# Altium project МПСУ.464414.22-01.PrjPcb
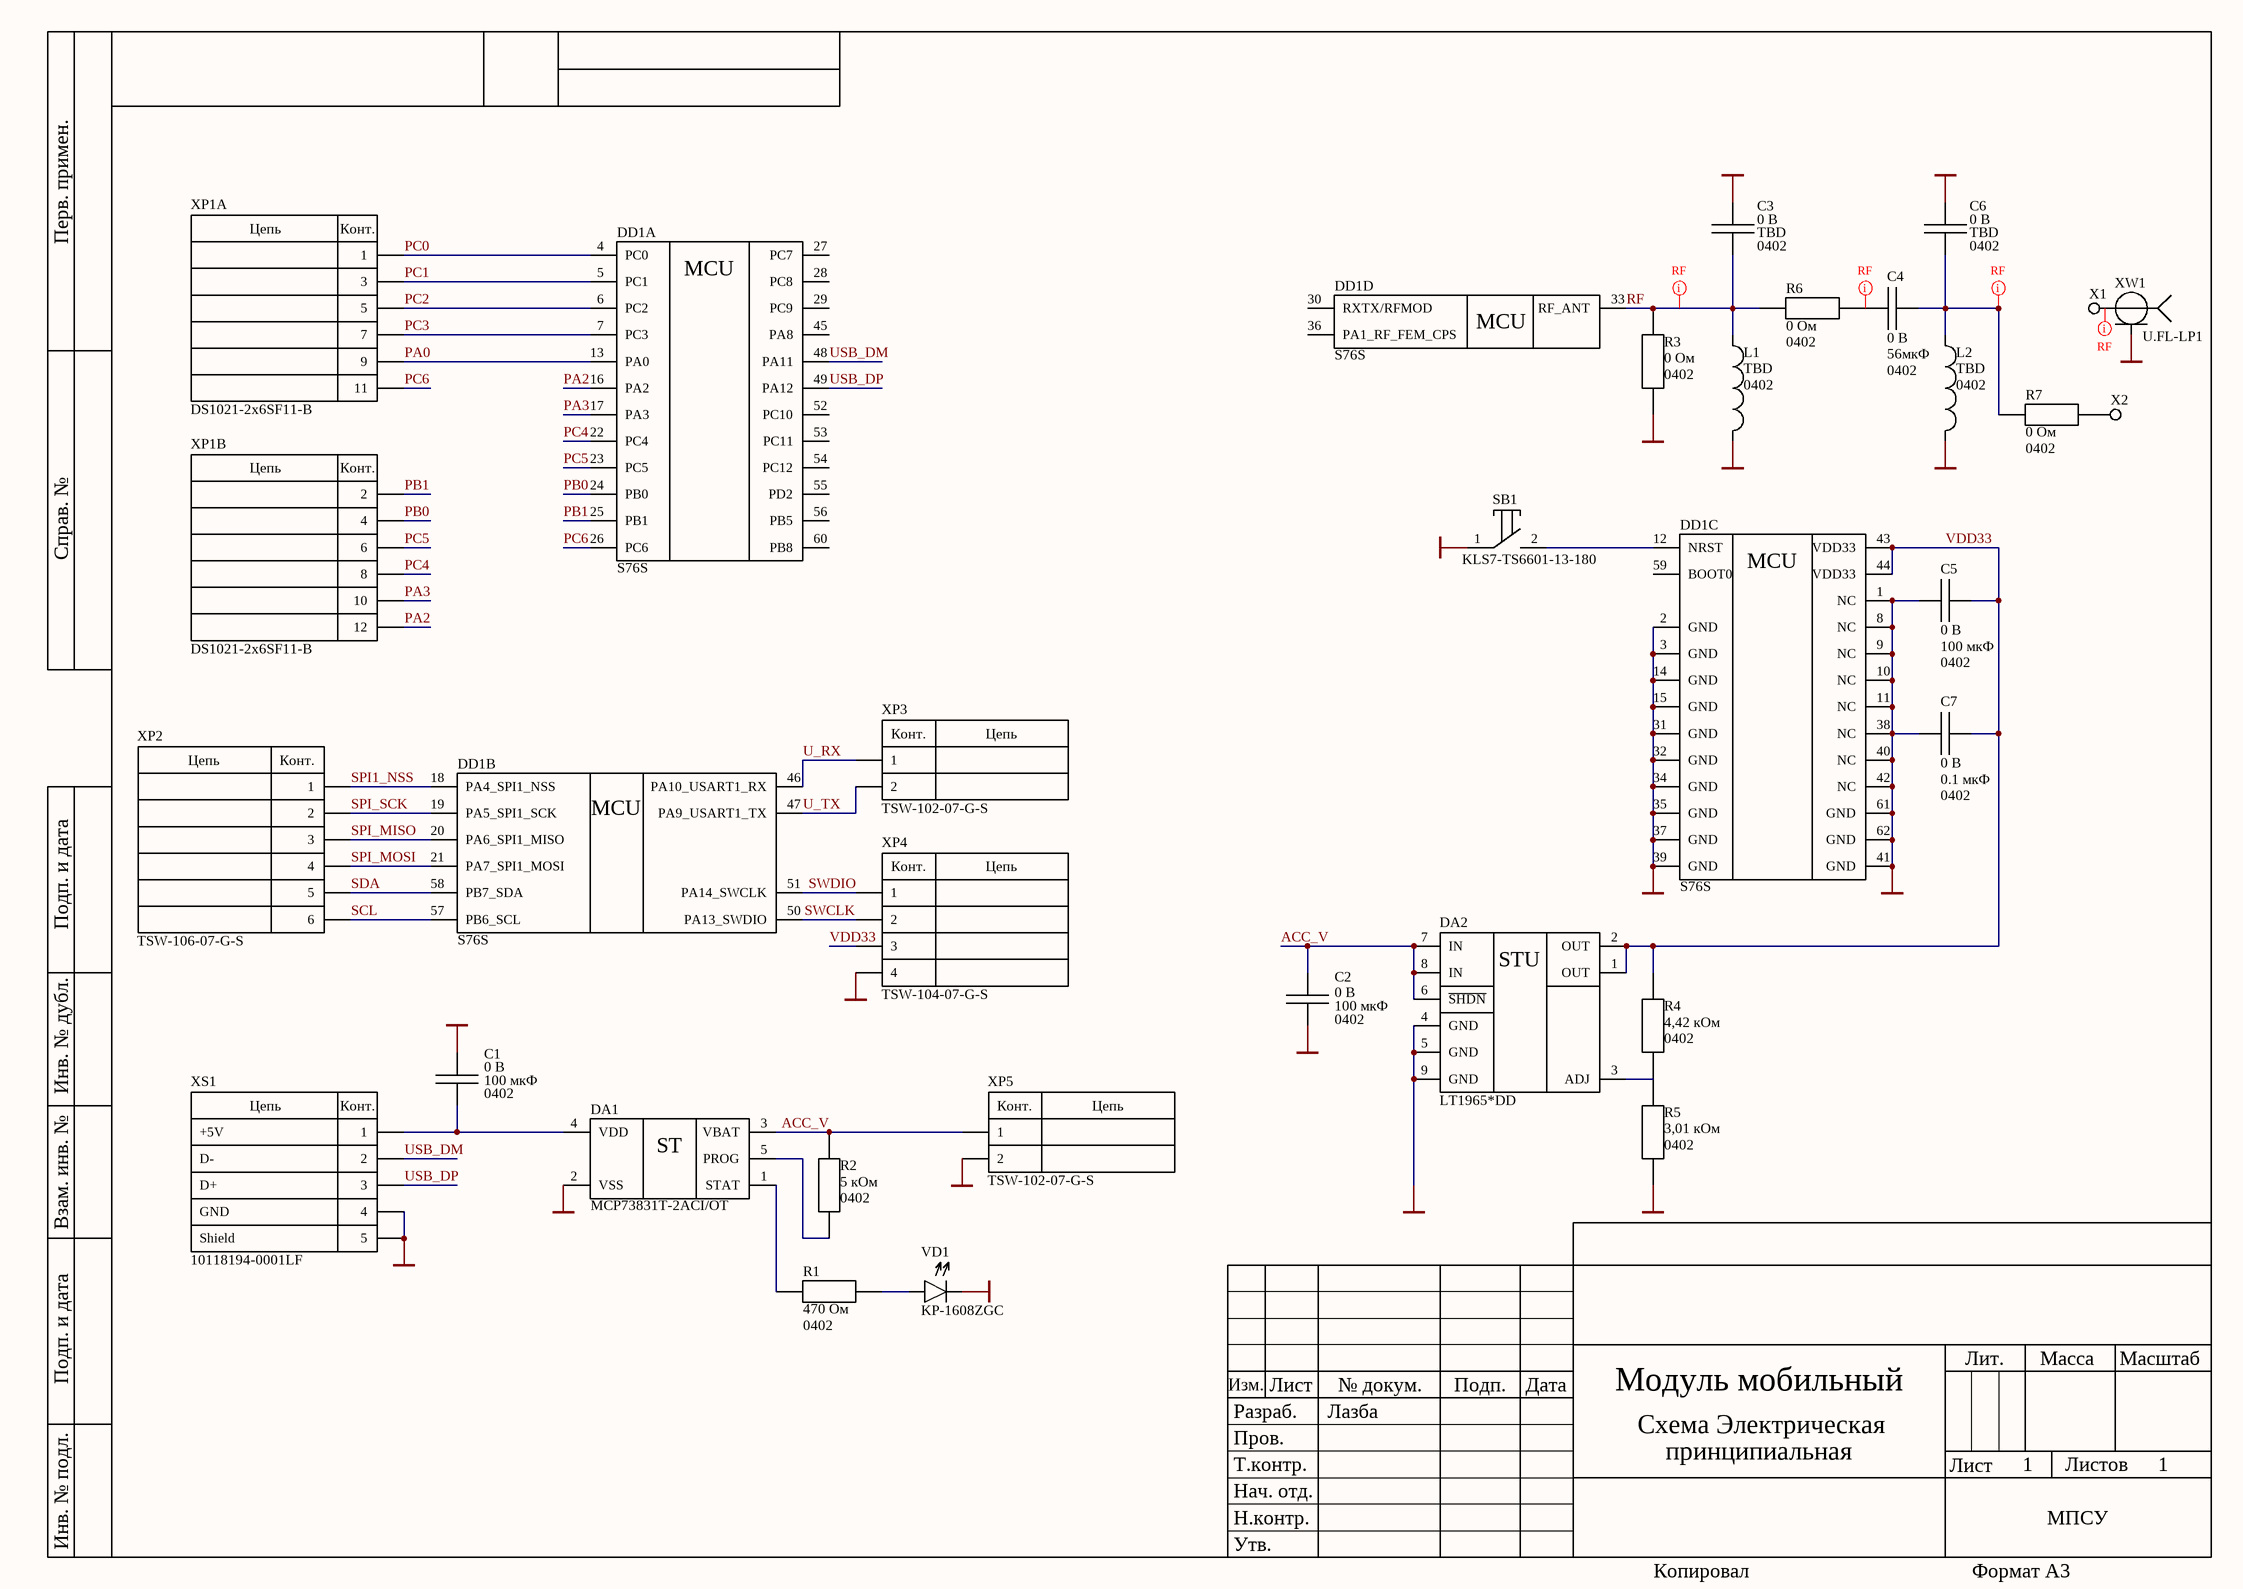
[diagram p0: МПСУ.464414.22-01 Sheet1.SchDoc]
PCBxIZMxD1: Д1; PCBxIZMxSB: СБ; PCBxIZMxSP: СП; PCBxIZMxT5M: 00; PCBxObozna4enie: МПСУ.687251.22-01; PCBxTitle: Плата; PCBxTYPExSB: СБ; UZELxIZMxE3: Э3; UZELxIZMxSB: СБ; UZELxObozna4enie: МПСУ.464414.22-01; UZELxTitle: Узел; UZELxTYPExE3: Э3; Документация0: #МПСУ.464414.22-01#Сборочный чертеж (СБ)#СБ##; Документация1: #МПСУ.464414.22-01#Схема электрическая принципиальная (Э3)#Э3##; Документация2: #МПСУ.464414.22-01#Перечень элементов  (ПЭ3)#ПЭ3##; Документация3: #МПСУ.464414.22-01#Ведомость покупных изделий (ВП)#ВП##; Документация4: #МПСУ.687251.22-01#Плата. Данные проектирования (Д1)#Д1##; Документация5: #МПСУ.687251.22-01#Плата. Данные конструкции (Т5М)#Т5М##; Наименование: Модуль Мобильный; Наименование1: Модуль Мобильный; Наименование_PCB: Плата; Обозначение: МПСУ.464414.22-01; Обозначение_PCB: МПСУ.687251.22-01; Обозначение_Код: МПСУ.464414.22-01; п_Пров_Р: Орешкин; п_Разраб_Р: Лазба
1 sheet, 30 parts. Net scope: global (net labels, ports and power ports of the same name join across sheets).
Board files: МПСУ.687251.22-01.PcbDoc, МПСУ.687251.22-02.PcbDoc

## Sheet МПСУ.464414.22-01 Sheet1.SchDoc
size 420 x 297 mm; DrawnBy: Лазба; Organization: МПСУ; Address1: Address1; Address2: Address2; Address3: Address3; Address4: Address4; SheetNumber: 1; SheetTotal: 1; IzmVersionSCH: Э3; IzmTypeSCH: Э3; OboznachenieSCH: МПСУ.464414.22-01; DocumentTypeSCH: Э3; DocumentName1SCH: Модуль мобильный; DocumentName2SCH: Схема Электрическая; DocumentName3SCH: принципиальная

### Parts
C1  value 100 мкФ  Peak_Condition: 0 В  Package: 0402  [CAPC100X50X55L20N]  (hidden comment: 100 мкФ ± 0 % 0 В  0402)
C2  value 100 мкФ  Peak_Condition: 0 В  Package: 0402  [CAPC100X50X55L20N]  (hidden comment: 100 мкФ ± 0 % 0 В  0402)
C3  value TBD  Peak_Condition: 0 В  Package: 0402  [CAPC100X50X55L20N]  (hidden comment: TBD ± 0 % 0 В  0402)
C4  value 56мкФ  Peak_Condition: 0 В  Package: 0402  [CAPC100X50X55L20N]  (hidden comment: 56мкФ ± 0 % 0 В  0402)
C5  value 100 мкФ  Peak_Condition: 0 В  Package: 0402  [CAPC100X50X55L20N]  (hidden comment: 100 мкФ ± 0 % 0 В  0402)
C6  value TBD  Peak_Condition: 0 В  Package: 0402  [CAPC100X50X55L20N]  (hidden comment: TBD ± 0 % 0 В  0402)
C7  value 0.1 мкФ  Peak_Condition: 0 В  Package: 0402  [CAPC100X50X55L20N]  (hidden comment: 0.1 мкФ ± 0 % 0 В  0402)
DA1  MCP73831T-2ACI/OT  [SOTFL95P270X145-5N]
DA2  LT1965*DD  [SON9P50_300X300X80L40X25T244X160N]
DD1  DD1  [S7XS]  (value not drawn)  (parts A,B,C,D of 4)
L1  value TBD  Package: 0402  [INDC100X50X60L10N]  (hidden comment: TBD ± 0 % 0 А 0402)
L2  value TBD  Package: 0402  [INDC100X50X60L10N]  (hidden comment: TBD ± 0 % 0 А 0402)
R1  value 470 Ом  Package: 0402  [RESC100X50X40L25N]  (hidden comment: 470 Ом ± 0 % 0 Вт 0402)
R2  value 5 кОм  Package: 0402  [RESC100X50X40L25N]  (hidden comment: 5 кОм ± 0 % 0 Вт 0402)
R3  value 0 Ом  Package: 0402  [RESC100X50X40L25N]  (hidden comment: 0 Ом ± 0 % 0 Вт 0402)
R4  value 4,42 кОм  Package: 0402  [RESC100X50X40L25N]  (hidden comment: 4,42 кОм ± 0 % 0 Вт 0402)
R5  value 3,01 кОм  Package: 0402  [RESC100X50X40L25N]  (hidden comment: 3,01 кОм ± 0 % 0 Вт 0402)
R6  value 0 Ом  Package: 0402  [RESC100X50X40L25N]  (hidden comment: 0 Ом ± 0 % 0 Вт 0402)
R7  value 0 Ом  Package: 0402  [RESC100X50X40L25N]  (hidden comment: 0 Ом ± 0 % 0 Вт 0402)
SB1  PartNumber: KLS7-TS6601-13-180  [KLS7-TS6601]  (hidden comment: SB1)
VD1  KP-1608ZGC  [KP-1608ZGC]
X1  Contact Pad  [Contact_Pad 0.55x0.55]  (value not drawn)
X2  Contact Pad  [Contact_Pad 0.55x0.55]  (value not drawn)
XP1  DS1021-2x6SF11-B  [HDRV12W64P254_6X2_1524X508H600]  (parts A,B of 2)
XP2  TSW-106-07-G-S  [TSW-106-07-G-S]
XP3  TSW-102-07-G-S  [TSW-102-07-G-S]
XP4  TSW-104-07-G-S  [TSW-104-07-G-S]
XP5  TSW-102-07-G-S  [TSW-102-07-G-S]
XS1  10118194-0001LF  [micro_USB_TH]
XW1  U.FL-LP1  [U.FL-LP]

### Nets
GND: C1.1 C2.2 C3.2 C5.1 C6.2 C7.2 DA1.2(VSS) DA2.4(GND) DA2.5(GND) DA2.9(GND) DD1.1(NC) DD1.2(GND) DD1.3(GND) DD1.8(NC) DD1.9(NC) DD1.10(NC) DD1.11(NC) DD1.14(GND) DD1.15(GND) DD1.31(GND) DD1.32(GND) DD1.34(GND) DD1.35(GND) DD1.37(GND) DD1.38(NC) DD1.39(GND) DD1.40(NC) DD1.41(GND) DD1.42(NC) DD1.61(GND) DD1.62(GND) L1.2 L2.2 R3.2 R5.2 SB1.1 VD1.2 XP4.4 XP5.2 XS1.4 XS1.5 XW1.2(GND)
ACC_V: C2.1 DA1.3(VBAT) DA2.6(~{SHDN}) DA2.7(IN) DA2.8(IN) R2.2 XP5.1
PA0: DD1.13(PA0) XP1.9
PA2: DD1.16(PA2) XP1.12
PA3: DD1.17(PA3) XP1.10
PB0: DD1.24(PB0) XP1.4
PB1: DD1.25(PB1) XP1.2
PC0: DD1.4(PC0) XP1.1
PC1: DD1.5(PC1) XP1.3
PC2: DD1.6(PC2) XP1.5
PC3: DD1.7(PC3) XP1.7
PC4: DD1.22(PC4) XP1.8
PC5: DD1.23(PC5) XP1.6
PC6: DD1.26(PC6) XP1.11
RF: C3.1 DD1.33(RF_ANT) L1.1 R3.1 R6.1
SCL: DD1.57(PB6_SCL) XP2.6
SDA: DD1.58(PB7_SDA) XP2.5
SPI1_NSS: DD1.18(PA4_SPI1_NSS) XP2.1
SPI_MISO: DD1.20(PA6_SPI1_MISO) XP2.3
SPI_MOSI: DD1.21(PA7_SPI1_MOSI) XP2.4
SPI_SCK: DD1.19(PA5_SPI1_SCK) XP2.2
SWCLK: DD1.50(PA13_SWDIO) XP4.2
SWDIO: DD1.51(PA14_SWCLK) XP4.1
U_RX: DD1.46(PA10_USART1_RX) XP3.1
U_TX: DD1.47(PA9_USART1_TX) XP3.2
USB_DM: DD1.48(PA11) XS1.2
USB_DP: DD1.49(PA12) XS1.3
VDD33: C5.2 C7.1 DA2.1(OUT) DA2.2(OUT) DD1.43(VDD33) DD1.44(VDD33) R4.1 XP4.3
NetC1_2: C1.2 DA1.4(VDD) XS1.1
NetC4_1: C4.1 C6.1 L2.1 R7.1
NetC4_2: C4.2 R6.2
NetDA1_1: DA1.1(STAT) R1.1
NetDA1_5: DA1.5(PROG) R2.1
NetDA2_3: DA2.3(ADJ) R4.2 R5.1
NetDD1_12: DD1.12(NRST) SB1.2
NetR1_2: R1.2 VD1.1
NetR7_2: R7.2 X2.1(TestPoint)
NetX1_1: X1.1(TestPoint) XW1.1(RF)

Not connected (* = marked no-connect by the designer): DD1 27(PC7) 28(PC8) 29(PC9) 30(RXTX/RFMOD) 36(PA1_RF_FEM_CPS) 45(PA8) 52(PC10) 53(PC11) 54(PC12) 55(PD2) 56(PB5) 59(BOOT0) 60(PB8)

### Layout directives
net class RF: NetC4_1, NetC4_2, NetX1_1, RF

### Notes on the sheet
- Перв. примен.
- Справ. №
- Подп. и дата
- Инв. № дубл.
- Взам. инв. №
- Разраб.
- Изм.
- Лист
- № докум.
- Подп.
- Дата
- Лит.
- Масса
- Масштаб
- Пров.
- Т.контр.
- Листов
- Инв. № подл.
- Утв.
- Н.контр.
- Нач. отд.
- Копировал
- Формат А3
- (in symbol 10118194-0001LF) Цепь; Конт.; +5V; D-; D+; GND; Shield
- (in symbol DS1021-2x6SF11-B, part A) Цепь; Конт.
- (in symbol DS1021-2x6SF11-B, part B) Цепь; Конт.
- (in symbol LT1965*DD) STU
- (in symbol MCP7383*) ST
- (in symbol TSW-102-07-G-S) Конт.; Цепь
- (in symbol TSW-104-07-G-S) Конт.; Цепь
- (in symbol TSW-106-07-G-S) Цепь; Конт.

### Library data of the parts
C1-C7 = C 0402: Capacitor 0402; Tolerance: 0 %; Designer: Свидерский; 3D_Body: +; Category: Passive; Subcategory: Capacitor; Status: Approved
DA1 = MCP7383*: Miniature Single-Cell, Fully Integrated Li-Ion, / Li-Polymer Charge Management Controllers; Manufacturer: Microchip; Designer: Лазба; 3D_Body: +; ComponentLink1Description: Техническое описание; ComponentLink1URL: Q:\Libs\Descriptions_PDF\MCP73831-2.pdf; Category: IC; Subcategory: Power Supply; Status: Check; PartNumber: MCP73831T-2ACI/OT
DA2 = LT1965*DD: 1.1A, Low Noise,  Low Dropout Linear Regulator; Manufacturer: Analog Devices; Designer: Свидерский; 3D_Body: +; ComponentLink1URL: Q:\Libs\Descriptions_PDF\LT1965.pdf; ComponentLink1Description: Техническое описание; Subcategory: Power Supply; Category: IC; Package: 8-LEAD (3mm × 3mm) PLASTIC DFN; Status: Approved; PartNumber: LT1965*DD
DD1 = S76S: The S76S is designed & manufactured in a smallest form factor - SiP ( System in Package ). It integrate with Semtech SX1276 and a 32-bit ultra low power Cortex M0L MCU ( STM32L073x ), supporting global 863MHz ~ 928MHz ISM-Bands.; Manufacturer: AcSIP; Designer: Лазба; 3D_Body: +; ComponentLink1Description: Техническое описание; ComponentLink1URL: Q:\Libs\Descriptions_PDF\AcSIP S76S.pdf; Category: IC; Subcategory: MCU; Status: Check; PartNumber: S76S
L1 L2 = L 0402: Inductor 0402; Designer: Свидерский; 3D_Body: +; Tolerance: 0 %; Peak_Condition: 0 А; Category: Passive; Subcategory: Inductor; Status: Approved
R1-R7 = R 0402: Resistor 0402; Designer: Свидерский; 3D_Body: +; Tolerance: 0 %; Peak_Condition: 0 Вт; Category: Passive; Subcategory: Resistor; Status: Approved
SB1 = KLS7-TS6601*: 6x6 Tact Switch Series; Manufacturer: KLS electronic co ltd; Designer: Лазба; 3D_Body: +; ComponentLink1Description: Техническое описание; ComponentLink1URL: Q:\Libs\Descriptions_PDF\KLS7-TS6601.pdf; Category: Passive; Subcategory: Button; Status: Check
VD1 = KP-1608***: 1.6X0.8mm SMD CHIP LED LAMP; Manufacturer: Kingbright; 3D_Body: +; Designer: Ушакова; Category: Discrete; ComponentLink1Description: Техническое описание; ComponentLink1URL: Q:\Libs\Descriptions_PDF\KP-1608ZGC.pdf; Package: 1.6mmX0.8mm SMD LED; Status: Approved; Subcategory: Diode; PartNumber: KP-1608ZGC
X1 X2 = Contact Pad: Контактная площадка (1,5 х 1,5 мм) для запайки провода; 3D_Body: +; Designer: Свидерский; Category: Primitive; Subcategory: Pad; Status: Approved
XP1 = DS1021-2x6SF11-B: Вилка 2,54мм; Manufacturer: Connfly Electronic; 3D_Body: +; Designer: Свидерский; Pitch: 2.54mm; System: Connector; ComponentLink1Description: Техническое описание; ComponentLink1URL: Q:\Libs\Descriptions_PDF\DS1021.pdf; Category: Connector; Subcategory: Male; Pins: 2x6; Status: Approved; PartNumber: DS1021-2x6SF11-B
XP2 = TSW-106-07-G-S: Вилка 2,54 мм; Manufacturer: Samtec; System: Connector; 3D_Body: +; Designer: Лазба; Pitch: 2.54mm; ComponentLink1Description: Техническое описание; ComponentLink1URL: Q:\Libs\Descriptions_PDF\tsw_th.pdf; Category: Connector; Subcategory: Male; Status: Check; Pins: 1x6; PartNumber: TSW-106-07-G-S
XP3 XP5 = TSW-102-07-G-S: 2x1 Вилка 2,54 мм; Manufacturer: Samtec; System: Connector; 3D_Body: +; Designer: Погорельский; Pitch: 2.54mm; ComponentLink1Description: Техническое описание; ComponentLink1URL: Q:\Libs\Descriptions_PDF\tsw_th.pdf; Category: Connector; Subcategory: Male; Status: Check; Pins: 2х1; PartNumber: TSW-102-07-G-S
XP4 = TSW-104-07-G-S: Вилка 2,54 мм; Manufacturer: Samtec; System: Connector; 3D_Body: +; Designer: Затонская; Pitch: 2.54mm; ComponentLink1Description: Техническое описание; ComponentLink1URL: Q:\Libs\Descriptions_PDF\tsw_th.pdf; Category: Connector; Subcategory: Male; Status: Check; Pins: 1x4; PartNumber: TSW-104-07-G-S
XS1 = 10118194-0001LF: micro USB, Through Hole Mount; Manufacturer: Amphenal ICC; 3D_Body: +; Designer: Свидерский; System: Connector; ComponentLink1Description: Техническое описание; ComponentLink1URL: Q:\Libs\Descriptions_PDF\10118194-0001LF.pdf; Category: Connector; Subcategory: microUSB; Pins: 5; Pitch: -; Status: Approved; PartNumber: 10118194-0001LF
XW1 = U.FL-R-SMT: RF connector, Right Angle Jack PCB SMA Female End Launch Connector; Manufacturer: Hirose Electric; 3D_Body: +; Designer: Лазба; ComponentLink1Description: Техническое описание; ComponentLink1URL: Q:\Libs\Descriptions_PDF\U.FL-R-SMT(01).pdf; Category: Connector; Subcategory: RF; Pins: UFL; Status: Check; System: Connector; PartNumber: U.FL-LP1